# EAGLE design d3vice-controlpoint-xbee (EAGLE 9.2.2)
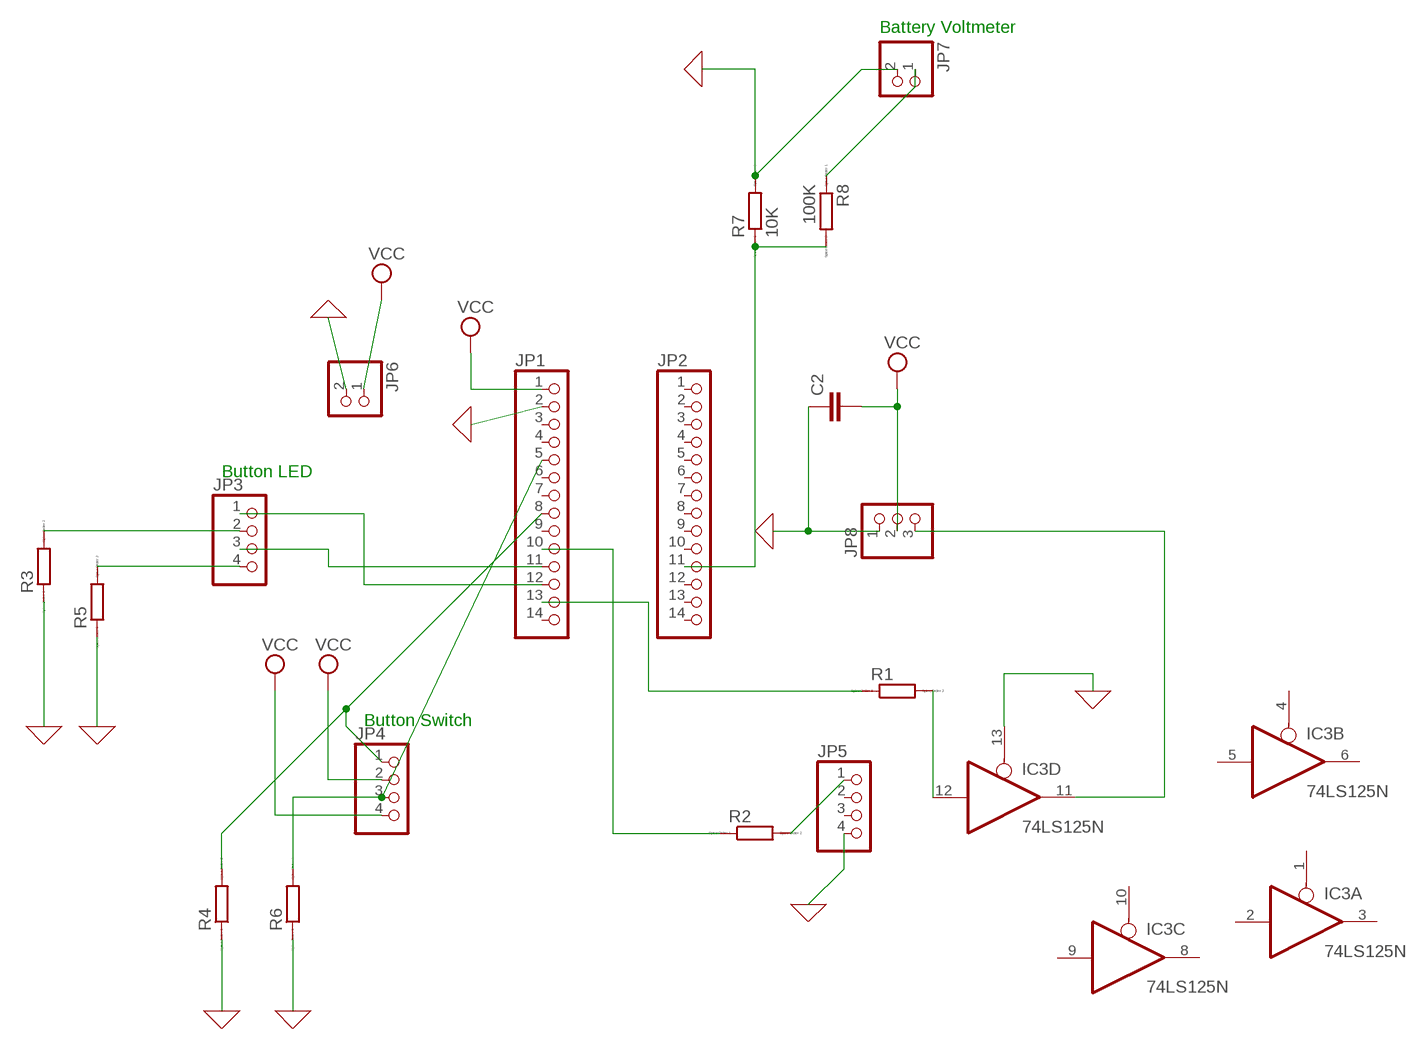
[diagram p0: schematic, sheet 1]

## Parts
C2  C-EU050-045X075  [C050-045X075]
IC3  74LS125N  [DIL14]
JP1  PINHD-1X14  [1X14]
JP2  PINHD-1X14  [1X14]
JP3  PINHD-1X4  [1X04]
JP4  PINHD-1X4  [1X04]
JP5  PINHD-1X4  [1X04]
JP6  PINHD-1X2  [1X02]
JP7  PINHD-1X2  [1X02]
JP8  PINHD-1X3  [1X03]
R1  R0204/7  [0204/7]
R2  R0204/7  [0204/7]
R3  R0204/7  [0204/7]
R4  R0204/7  [0204/7]
R5  R0204/7  [0204/7]
R6  R0204/7  [0204/7]
R7  10K  R0204/7  [0204/7]
R8  100K  R0204/7  [0204/7]

## Nets
0: JP7.2 R7.2 ; supply symbol labelled GND
GND: C2.1 IC3.13(D:OE) JP1.2 JP5.4 JP6.2 JP8.1 R3.1 R4.1 R5.1 R6.1
N$1: JP2.11 R7.1 R8.2
N$2: IC3.11(D:O) JP8.3
N$3: IC3.12(D:I) R1.2
N$4: JP5.1 R2.2
N$5: JP1.5 JP4.3 R6.2
N$6: JP1.13 R1.1
N$7: JP1.10 R2.1
N$8: JP1.11 JP3.3
N$9: JP3.4 R5.2
N$10: JP3.2 R3.2
N$11: JP1.12 JP3.1
N$12: JP7.1 R8.1
N$13: JP1.8 JP4.1 R4.2
VCC: C2.2 JP1.1 JP4.2 JP4.4 JP6.1 JP8.2
Unconnected: IC3.1(A:OE) IC3.2(A:I) IC3.3(A:O) IC3.4(B:OE) IC3.5(B:I) IC3.6(B:O) IC3.8(C:O) IC3.9(C:I) IC3.10(C:OE) JP1.3 JP1.4 JP1.6 JP1.7 JP1.9 JP1.14 JP2.1 JP2.2 JP2.3 JP2.4 JP2.5 JP2.6 JP2.7 JP2.8 JP2.9 JP2.10 JP2.12 JP2.13 JP2.14 JP5.2 JP5.3

## Notes on the sheet
- Battery Voltmeter
- Button LED
- Button Switch

## Power pins joined to a net without a drawn wire
GND: IC3.7(P:GND)
VCC: IC3.14(P:VCC)

## Library data of the parts
C2 = rcl:C-EU: CAPACITOR, European symbol; SPICEPREFIX: C
IC3 = 74xx-us:74*125: Quad bus BUFFER, 3-state
JP1 JP2 = pinhead:PINHD-1X14: PIN HEADER
JP3-JP5 = pinhead:PINHD-1X4: PIN HEADER
JP6 JP7 = pinhead:PINHD-1X2: PIN HEADER
JP8 = pinhead:PINHD-1X3: PIN HEADER
R1-R8 = eagle-ltspice:R: RESISTOR, European symbol; SPICEMODEL: NONE; SPICEPREFIX: R

## Net classes
0 default: width 0.305 mm, drill 0.508 mm, clearance 0.508 mm

## Board
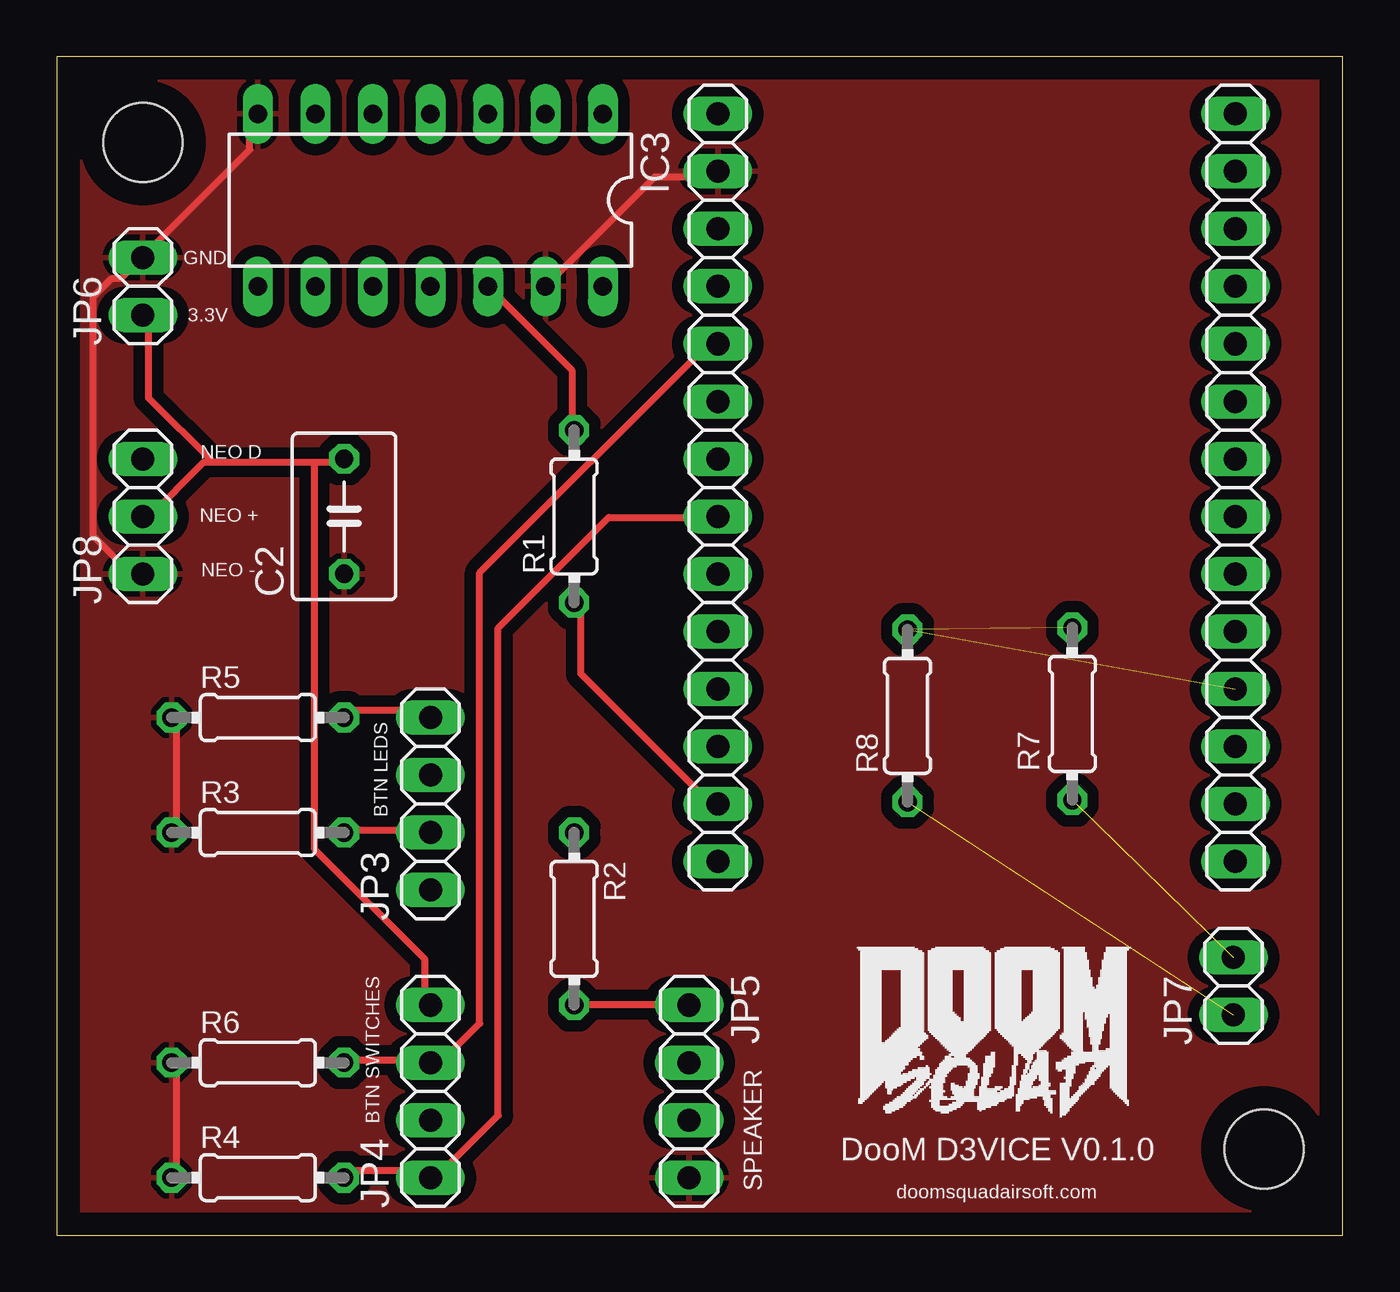
[diagram p1: board, top side]
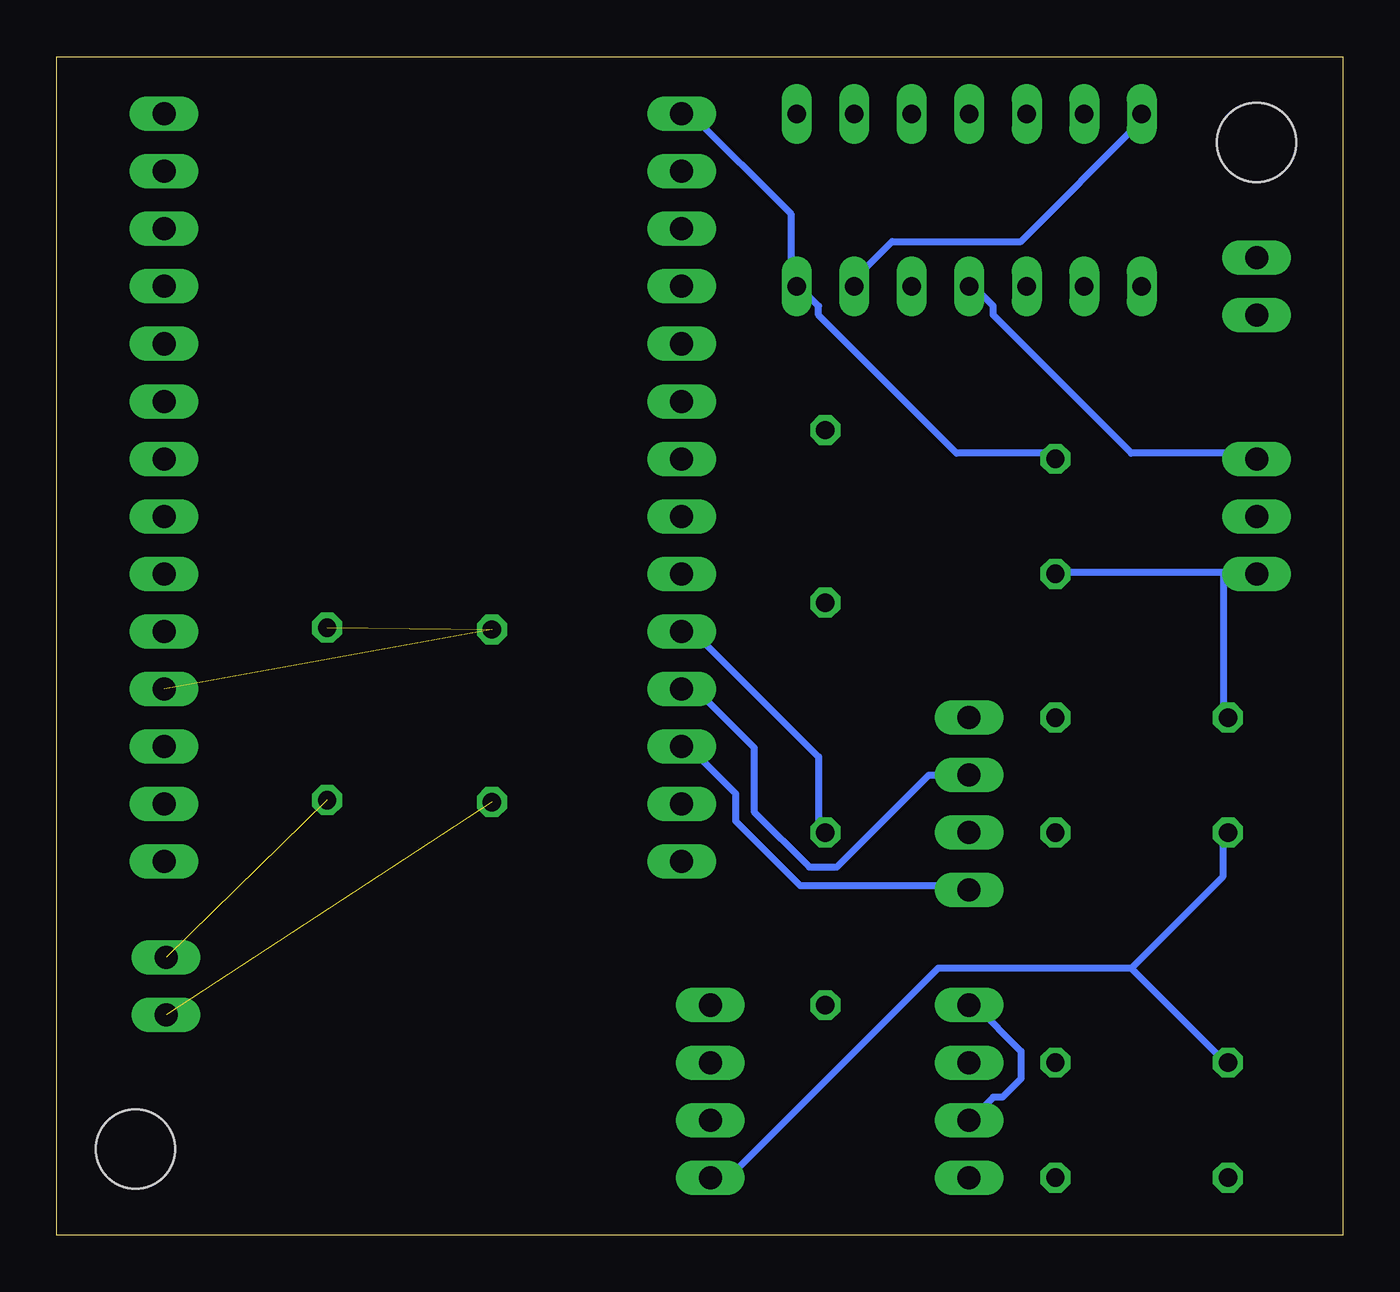
[diagram p2: board, bottom side, seen from below]

Size 56.82 x 52.06 mm. Coordinates in mm from the lower left corner, seen from the top.
Outline: 0,0 56.82,0 56.82,52.06 0,52.06 0,0
Copper layers (1*16): Top 0.035mm / dielectric 1.5mm / Bottom 0.035mm
Design rules "default": minimum track width 6mil, minimum drill 0.35mm, track to track 6mil, track to pad 6mil, pad to pad 6mil, via to via 6mil, smd to smd 6mil, copper to edge 40mil, drill to drill 6mil, minimum pad ring 10mil, minimum via ring 8mil, stop-mask expansion 4mil, vias tented up to drill 0mil, thermal gap 10mil
Holes 3.5 mm at 3.81,48.26 53.34,3.81

### Footprints (pad centres in the part's own frame; a part is rotated, then mirrored left to right if it is on the bottom)
C050-045X075 = drill 0.813 octagon: 1 -2.54,0; 2 2.54,0
DIL14 = drill 0.813 long: 1 -7.62,-3.81; 2 -5.08,-3.81; 3 -2.54,-3.81; 4 0,-3.81; 5 2.54,-3.81; 6 5.08,-3.81; 7 7.62,-3.81; 8 7.62,3.81; 9 5.08,3.81; 10 2.54,3.81; 11 0,3.81; 12 -2.54,3.81; 13 -5.08,3.81; 14 -7.62,3.81
1X14 = drill 1.016 long: 1 -16.51,0; 2 -13.97,0; 3 -11.43,0; 4 -8.89,0; 5 -6.35,0; 6 -3.81,0; 7 -1.27,0; 8 1.27,0; 9 3.81,0; 10 6.35,0; 11 8.89,0; 12 11.43,0; 13 13.97,0; 14 16.51,0
1X04 = drill 1.016 long: 1 -3.81,0; 2 -1.27,0; 3 1.27,0; 4 3.81,0
1X02 = drill 1.016 long: 1 -1.27,0; 2 1.27,0
1X03 = drill 1.016 long: 1 -2.54,0; 2 0,0; 3 2.54,0
0204/7 = drill 0.813 octagon: 1 -3.81,0; 2 3.81,0

### Placement (x,y rotation side)
C2  12.7,31.75 90 top
IC3  16.51,45.72 180 top
JP1  29.21,33.02 270 top
JP2  52.07,33.02 270 top
JP3  16.51,19.05 90 top
JP4  16.51,6.35 90 top
JP5  27.94,6.35 270 top
JP6  3.81,41.91 90 top
JP7  51.98,11.01 90 top
JP8  3.81,31.75 90 top
R1  22.86,31.75 90 top
R2  22.86,13.97 270 top
R3  8.89,17.78 0 top
R4  8.89,2.54 0 top
R5  8.89,22.86 0 top
R6  8.89,7.62 0 top
R7  44.87,23.03 270 top
R8  37.59,22.94 90 top

### Tracks (layer width: path | path; a pad name or v marks a point on that pad's centre or on a via)
0  (1 unrouted)
GND
  Top 0.305: IC3.7 8.53,49.17 8.53,47.95 4.06,43.48 JP6.2 3.66,43.08 2.85,42.27 2.44,42.27 1.63,41.45 1.63,30.89 3.66,28.85 JP8.1 | IC3.13 26.42,46.74 28.85,46.74 JP1.2 | R3.1 5.28,17.88 5.28,22.76 R5.1 | R4.1 5.28,2.85 5.28,7.32 R6.1
  Bottom 0.305: IC3.7 8.94,49.17 14.22,43.89 19.91,43.89 21.54,42.27 IC3.13 | 5.28,29.26 4.06,29.26 JP8.1 5.28,29.26 | 5.28,29.26 12.6,29.26 C2.1 | 5.28,29.26 5.28,23.16 R5.1 | 9.35,11.79 17.88,11.79 26.82,2.85 27.64,2.85 JP5.4 | 9.35,11.79 5.28,7.72 R6.1 | 9.35,11.79 5.28,15.85 5.28,17.48 R3.1
  pour Top: -1.27,-1.27 -1.27,53.34 58.42,53.34 58.42,-1.27
N$1  (2 unrouted)
N$2
  Bottom 0.305: IC3.11 16.26,41.86 15.44,41.05 15.44,40.64 9.35,34.54 4.06,34.54 JP8.3
N$3
  Top 0.305: IC3.12 22.76,38.2 22.76,35.76 R1.2
N$4
  Top 0.305: JP5.1 R2.2
N$5
  Top 0.305: R6.2 13.01,7.72 16.26,7.72 JP4.3 16.66,7.32 18.69,9.35 18.69,29.26 28.45,39.01 28.85,39.01 JP1.5
N$6
  Top 0.305: R1.1 23.16,27.64 23.16,24.79 28.85,19.1 JP1.13
N$7
  Bottom 0.305: R2.1 23.16,17.88 23.16,21.13 28.85,26.82 JP1.10
N$8
  Bottom 0.305: JP3.3 18.29,20.32 22.35,16.26 23.57,16.26 26.01,18.69 26.01,21.54 28.85,24.38 JP1.11
N$9
  Top 0.305: R5.2 13.01,23.16 16.26,23.16 JP3.4
N$10
  Top 0.305: R3.2 13.01,17.88 16.26,17.88 JP3.2
N$11
  Bottom 0.305: JP3.1 16.66,15.44 23.98,15.44 26.82,18.29 26.82,19.51 28.85,21.54 JP1.12
N$12  (1 unrouted)
N$13
  Top 0.305: R4.2 13.01,2.85 16.26,2.85 JP4.1 16.66,2.44 19.51,5.28 19.51,26.82 24.38,31.7 28.85,31.7 JP1.8
VCC
  Top 0.305: 6.91,34.14 6.5,34.14 4.06,31.7 JP8.2 | 6.91,34.14 11.38,34.14 | 11.38,34.14 12.6,34.14 C2.2 | 6.91,34.14 4.06,36.98 4.06,40.64 JP6.1 | 11.38,34.14 11.38,17.07 16.26,12.19 16.26,10.16 JP4.4
  Bottom 0.305: JP1.1 28.85,49.58 24.38,45.11 24.38,42.27 IC3.14 23.98,41.86 23.16,41.05 23.16,40.64 17.07,34.54 13.01,34.54 C2.2 | JP4.2 16.26,5.28 15.44,6.1 15.04,6.1 14.22,6.91 14.22,8.13 16.26,10.16 JP4.4

### Text on the board
tPlace: DooM D3VICE V0.1.0 | doomsquadairsoft.com
tNames: GND | 3.3V | NEO D | NEO + | NEO - | BTN LEDS | BTN SWITCHES | SPEAKER